# Altium schematic sheet 60_WIFI_RTL8723DS.SchDoc
size A4
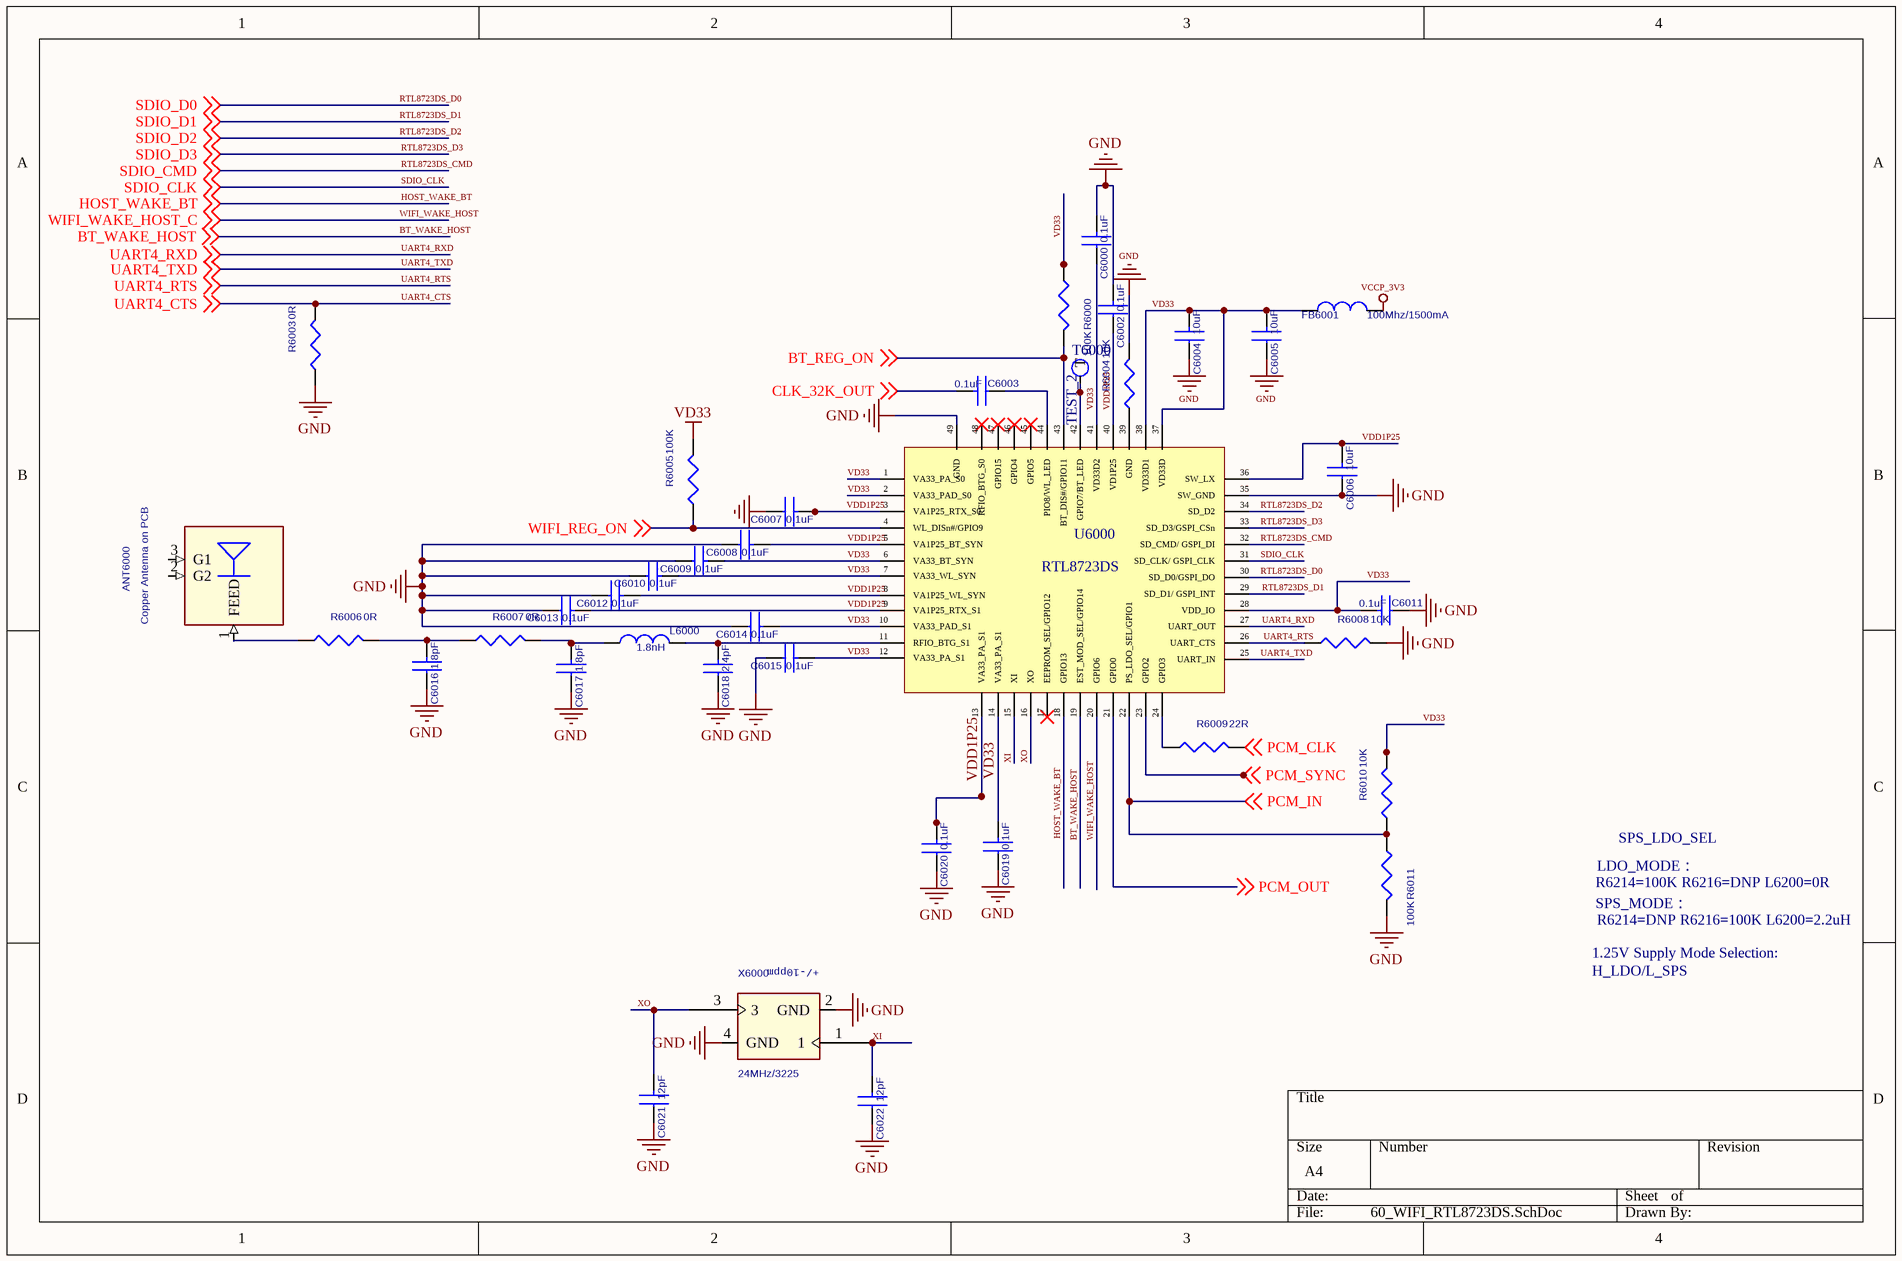
[diagram p0: 60_WIFI_RTL8723DS.SchDoc]

## Parts
ANT6000  NOTE: Copper Antenna on PCB  [ANT]  (hidden comment: N/A)
C6000  0.1uF  [C0402]
C6002  0.1uF  [C0402]
C6003  0.1uF  [C0402]
C6004  10uF  [C0603]
C6005  10uF  [C0603]
C6006  10uF  [C0603]
C6007  0.1uF  [C0402]
C6008  0.1uF  [C0402]
C6009  0.1uF  [C0402]
C6010  0.1uF  [C0402]
C6011  0.1uF  [C0402]
C6012  0.1uF  [C0402]
C6013  0.1uF  [C0402]
C6014  0.1uF  [C0402]
C6015  0.1uF  [C0402]
C6016  1.8pF  [C0402]
C6017  1.8pF  [C0402]
C6018  2.4pF  [C0402]
C6019  0.1uF  [C0402]
C6020  0.1uF  [C0402]
C6021  12pF  [C0402]
C6022  12pF  [C0402]
FB6001  100Mhz/1500mA  [L0603]
L6000  1.8nH  [R0402]
R6000  100K  [R0402]
R6003  0R  [R0402]
R6004  10K  [R0402]
R6005  100K  [R0402]
R6006  0R  [R0402]
R6007  0R  [R0402]
R6008  10K  [R0402]
R6009  22R  [R0402]
R6010  10K  [R0402]
R6011  100K  [R0402]
T6000  TEST_2  [TEST]
U6000  RTL8723DS  [RTL8723DS]
X6000  24MHz/3225  [CRY-D3225]

## Nets
GND: C6000.2 C6002.2 C6004.1 C6005.1 C6006.1 C6007.1 C6008.1 C6009.1 C6010.1 C6011.1 C6012.1 C6013.1 C6014.1 C6015.1 C6016.1 C6017.1 C6018.1 C6019.1 C6020.1 C6021.1 C6022.1 R6003.1 R6004.2 R6008.2 R6011.2 U6000.35(SW_GND) U6000.49(GND) X6000.2(GND) X6000.4(GND)
VCCP_3V3: FB6001.2
VD33: C6000.1 C6004.2 C6005.2 C6009.2 C6010.2 C6011.2 C6014.2 C6015.2 C6019.2 FB6001.1 R6000.1 R6005.2 R6010.2 U6000.1(VA33_PA_S0) U6000.2(VA33_PAD_S0) U6000.6(VA33_BT_SYN) U6000.7(VA33_WL_SYN) U6000.10(VA33_PAD_S1) U6000.12(VA33_PA_S1) U6000.14(VA33_PA_S1) U6000.28(VDD_IO) U6000.37(VD33D) U6000.38(VD33D1) U6000.41(VD33D2)
BT_REG_ON: R6000.2 U6000.43(BT_DIS#/GPIO11) ; off-sheet BT_REG_ON
BT_WAKE_HOST: U6000.19(EST_MOD_SEL/GPIO14) ; off-sheet BT_WAKE_HOST
CLK_32K_OUT: C6003.2 ; off-sheet CLK_32K_OUT
HOST_WAKE_BT: U6000.18(GPIO13) ; off-sheet HOST_WAKE_BT
PCM_CLK: R6009.2 ; off-sheet PCM_CLK
PCM_IN: R6010.1 R6011.1 U6000.22(PS_LDO_SEL/GPIO1) ; off-sheet PCM_IN
PCM_OUT: U6000.21(GPIO0) ; off-sheet PCM_OUT
PCM_SYNC: U6000.23(GPIO2) ; off-sheet PCM_SYNC
RTL8723DS_CMD: U6000.32(SD_CMD/_GSPI_DI) ; off-sheet SDIO_CMD  [also labelled SDIO_CMD]
RTL8723DS_D0: U6000.30(SD_D0/GSPI_DO) ; off-sheet SDIO_D0  [also labelled SDIO_D0]
RTL8723DS_D1: U6000.29(SD_D1/_GSPI_INT) ; off-sheet SDIO_D1  [also labelled SDIO_D1]
RTL8723DS_D2: U6000.34(SD_D2) ; off-sheet SDIO_D2  [also labelled SDIO_D2]
RTL8723DS_D3: U6000.33(SD_D3/GSPI_CSn) ; off-sheet SDIO_D3  [also labelled SDIO_D3]
SDIO_CLK: U6000.31(SD_CLK/_GSPI_CLK) ; off-sheet SDIO_CLK
UART4_CTS: R6003.2 ; off-sheet UART4_CTS
UART4_RTS: R6008.1 U6000.26(UART_CTS) ; off-sheet UART4_RTS
UART4_RXD: U6000.27(UART_OUT) ; off-sheet UART4_RXD
UART4_TXD: U6000.25(UART_IN) ; off-sheet UART4_TXD
VDD1P25: C6002.1 C6006.2 C6007.2 C6008.2 C6012.2 C6013.2 C6020.2 U6000.3(VA1P25_RTX_S0) U6000.5(VA1P25_BT_SYN) U6000.8(VA1P25_WL_SYN) U6000.9(VA1P25_RTX_S1) U6000.13(VA33_PA_S1) U6000.36(SW_LX) U6000.40(VD1P25)
WIFI_REG_ON: R6005.1 U6000.4(WL_DISn#/GPIO9) ; off-sheet WIFI_REG_ON
WIFI_WAKE_HOST: U6000.20(GPIO6) ; off-sheet WIFI_WAKE_HOST_C  [also labelled WIFI_WAKE_HOST_C]
XI: C6022.2 U6000.15(XI) X6000.1
XO: C6021.2 U6000.16(XO) X6000.3
NetANT6000_1: ANT6000.1(FEED) R6006.1
NetC6003_1: C6003.1 U6000.44(PIO8/WL_LED)
NetC6016_2: C6016.2 R6006.2 R6007.1
NetC6017_2: C6017.2 L6000.1 R6007.2
NetC6018_2: C6018.2 L6000.2 U6000.11(RFIO_BTG_S1)
NetR6004_1: R6004.1 U6000.39(GND)
NetR6009_1: R6009.1 U6000.24(GPIO3)
NetT6000_1: T6000.1(T) U6000.42(GPIO7/BT_LED)

Not connected (* = marked no-connect by the designer): ANT6000 2(G2) 3(G1); U6000 17(EEPROM_SEL/GPIO12)* 45(GPIO5)* 46(GPIO4)* 47(GPIO15)* 48(RFIO_BTG_S0)*

## Notes on the sheet
- LDO_MODE：
- SPS_LDO_SEL
- 1.25V Supply Mode Selection:
- R6214=100K R6216=DNP L6200=0R
- SPS_MODE：
- R6214=DNP R6216=100K L6200=2.2uH
- H_LDO/L_SPS
- (in symbol XTAL/26MHz/3225) +/-10ppm

## Library data of the parts
ANT6000 = ANT_IIFA_CC2420_32mil_MIR: Manufacturer Part Number: IIFA_CC2420; Manufacturer: N/A; Part Description: ANT_IIFA_CC2420_32mil_MIR
C6000 C6002-C6022 = C/0603
FB6001 = L/0603
L6000 = L/0402
R6000 R6003-R6011 = R/0402(H)
X6000 = XTAL/26MHz/3225